# Altium schematic sheet 04 MCU_AB.SchDoc
size 513 x 386 mm
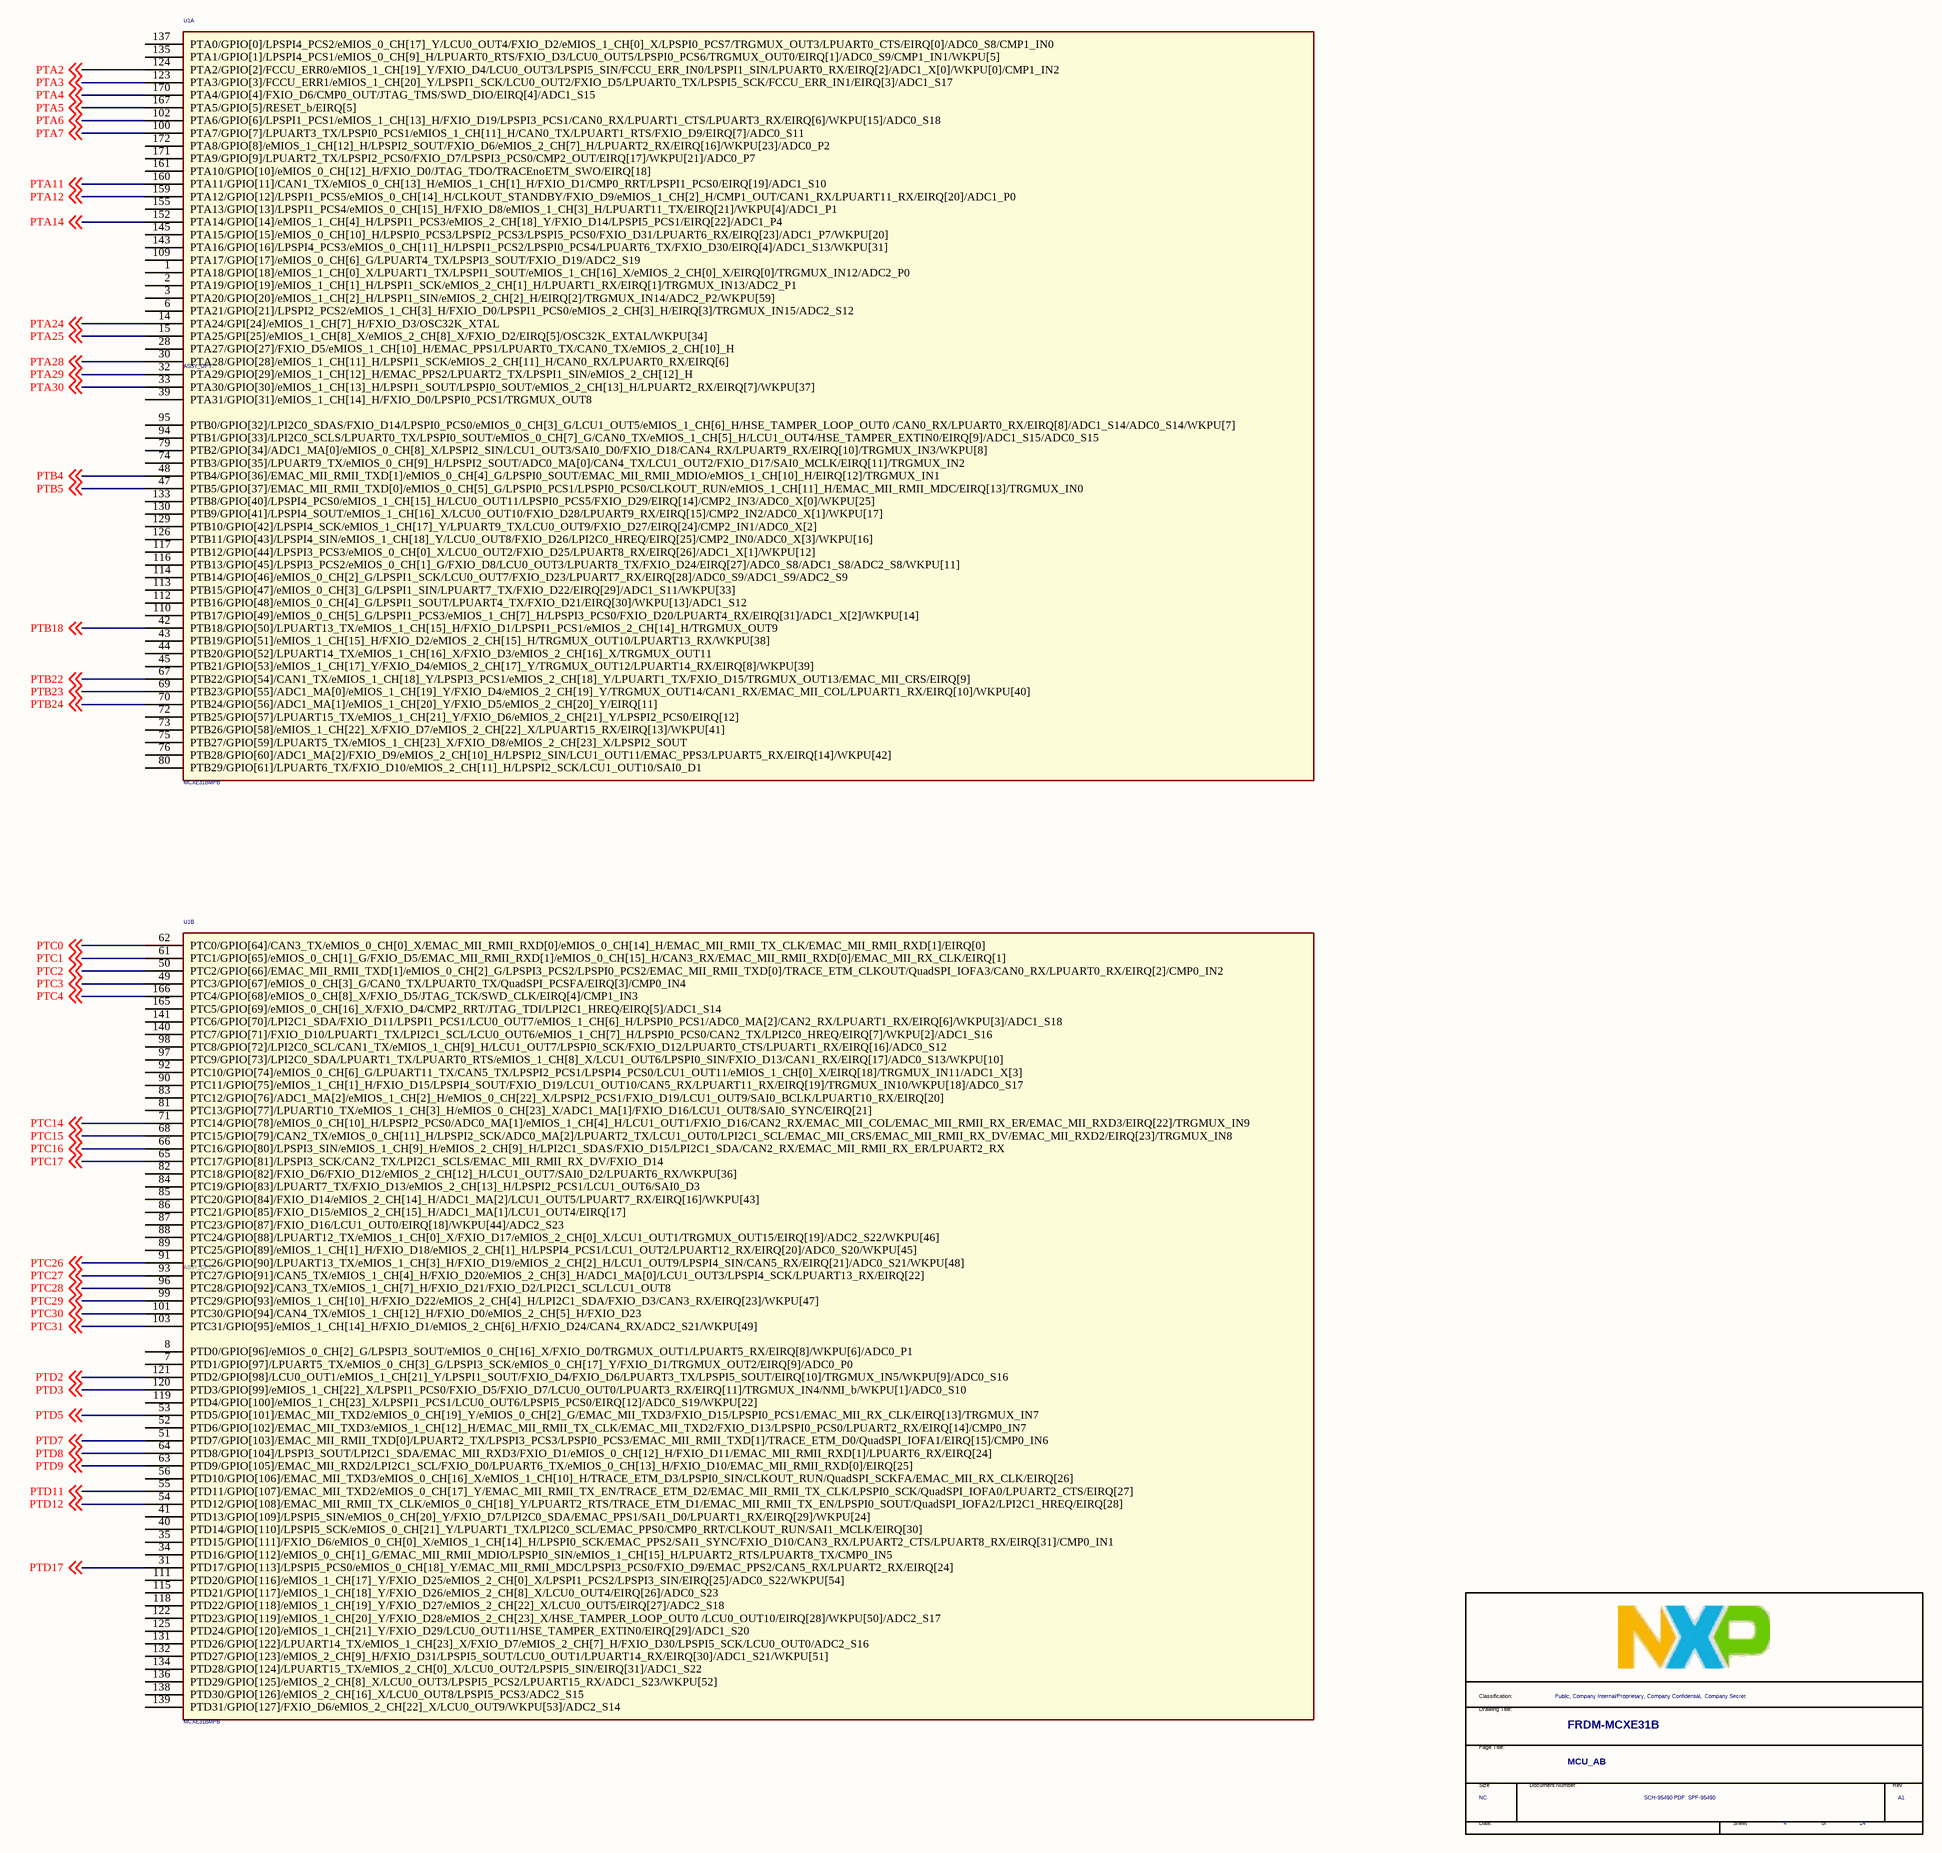
[diagram p0: 04 MCU_AB.SchDoc]

## Parts
*  Title: FRDM-MCXE31B  RevCode: A1  PageTitle: MCU_AB  Page Size: NC  Page Number: 4  Page Count: 14  Doc: SCH-95490 PDF: SPF-95490  Classification: Public, Company Internal/Proprietary, Company Confidential,  Company Secret  (hidden comment: TitleBlock_FS)  (graphical)
U1  MCXE31BMPB  [QFP-172_L16.0-W16.0-P0.65-LS19.0-TL]  (parts A,B of 4)

## Nets
PTA2: U1.124(PTA2/GPIO[2]/FCCU_ERR0/eMIOS_1_CH[19]_Y/FXIO_D4/LCU0_OUT3/LPSPI5_SIN/FCCU_ERR_IN0/LPSPI1_SIN/LPUART0_RX/EIRQ[2]/ADC1_X[0]/WKPU[0]/CMP1_IN2) ; off-sheet PTA2
PTA3: U1.123(PTA3/GPIO[3]/FCCU_ERR1/eMIOS_1_CH[20]_Y/LPSPI1_SCK/LCU0_OUT2/FXIO_D5/LPUART0_TX/LPSPI5_SCK/FCCU_ERR_IN1/EIRQ[3]/ADC1_S17) ; off-sheet PTA3
PTA4: U1.170(PTA4/GPIO[4]/FXIO_D6/CMP0_OUT/JTAG_TMS/SWD_DIO/EIRQ[4]/ADC1_S15) ; off-sheet PTA4
PTA5: U1.167(PTA5/GPIO[5]/RESET_b/EIRQ[5]) ; off-sheet PTA5
PTA6: U1.102(PTA6/GPIO[6]/LPSPI1_PCS1/eMIOS_1_CH[13]_H/FXIO_D19/LPSPI3_PCS1/CAN0_RX/LPUART1_CTS/LPUART3_RX/EIRQ[6]/WKPU[15]/ADC0_S18) ; off-sheet PTA6
PTA7: U1.100(PTA7/GPIO[7]/LPUART3_TX/LPSPI0_PCS1/eMIOS_1_CH[11]_H/CAN0_TX/LPUART1_RTS/FXIO_D9/EIRQ[7]/ADC0_S11) ; off-sheet PTA7
PTA11: U1.160(PTA11/GPIO[11]/CAN1_TX/eMIOS_0_CH[13]_H/eMIOS_1_CH[1]_H/FXIO_D1/CMP0_RRT/LPSPI1_PCS0/EIRQ[19]/ADC1_S10) ; off-sheet PTA11
PTA12: U1.159(PTA12/GPIO[12]/LPSPI1_PCS5/eMIOS_0_CH[14]_H/CLKOUT_STANDBY/FXIO_D9/eMIOS_1_CH[2]_H/CMP1_OUT/CAN1_RX/LPUART11_RX/EIRQ[20]/ADC1_P0) ; off-sheet PTA12
PTA14: U1.152(PTA14/GPIO[14]/eMIOS_1_CH[4]_H/LPSPI1_PCS3/eMIOS_2_CH[18]_Y/FXIO_D14/LPSPI5_PCS1/EIRQ[22]/ADC1_P4) ; off-sheet PTA14
PTA24: U1.14(PTA24/GPI[24]/eMIOS_1_CH[7]_H/FXIO_D3/OSC32K_XTAL) ; off-sheet PTA24
PTA25: U1.15(PTA25/GPI[25]/eMIOS_1_CH[8]_X/eMIOS_2_CH[8]_X/FXIO_D2/EIRQ[5]/OSC32K_EXTAL/WKPU[34]) ; off-sheet PTA25
PTA28: U1.30(PTA28/GPIO[28]/eMIOS_1_CH[11]_H/LPSPI1_SCK/eMIOS_2_CH[11]_H/CAN0_RX/LPUART0_RX/EIRQ[6]) ; off-sheet PTA28
PTA29: U1.32(PTA29/GPIO[29]/eMIOS_1_CH[12]_H/EMAC_PPS2/LPUART2_TX/LPSPI1_SIN/eMIOS_2_CH[12]_H) ; off-sheet PTA29
PTA30: U1.33(PTA30/GPIO[30]/eMIOS_1_CH[13]_H/LPSPI1_SOUT/LPSPI0_SOUT/eMIOS_2_CH[13]_H/LPUART2_RX/EIRQ[7]/WKPU[37]) ; off-sheet PTA30
PTB4: U1.48(PTB4/GPIO[36]/EMAC_MII_RMII_TXD[1]/eMIOS_0_CH[4]_G/LPSPI0_SOUT/EMAC_MII_RMII_MDIO/eMIOS_1_CH[10]_H/EIRQ[12]/TRGMUX_IN1) ; off-sheet PTB4
PTB5: U1.47(PTB5/GPIO[37]/EMAC_MII_RMII_TXD[0]/eMIOS_0_CH[5]_G/LPSPI0_PCS1/LPSPI0_PCS0/CLKOUT_RUN/eMIOS_1_CH[11]_H/EMAC_MII_RMII_MDC/EIRQ[13]/TRGMUX_IN0) ; off-sheet PTB5
PTB18: U1.42(PTB18/GPIO[50]/LPUART13_TX/eMIOS_1_CH[15]_H/FXIO_D1/LPSPI1_PCS1/eMIOS_2_CH[14]_H/TRGMUX_OUT9) ; off-sheet PTB18
PTB22: U1.67(PTB22/GPIO[54]/CAN1_TX/eMIOS_1_CH[18]_Y/LPSPI3_PCS1/eMIOS_2_CH[18]_Y/LPUART1_TX/FXIO_D15/TRGMUX_OUT13/EMAC_MII_CRS/EIRQ[9]) ; off-sheet PTB22
PTB23: U1.69(PTB23/GPIO[55]/ADC1_MA[0]/eMIOS_1_CH[19]_Y/FXIO_D4/eMIOS_2_CH[19]_Y/TRGMUX_OUT14/CAN1_RX/EMAC_MII_COL/LPUART1_RX/EIRQ[10]/WKPU[40]) ; off-sheet PTB23
PTB24: U1.70(PTB24/GPIO[56]/ADC1_MA[1]/eMIOS_1_CH[20]_Y/FXIO_D5/eMIOS_2_CH[20]_Y/EIRQ[11]) ; off-sheet PTB24
PTC0: U1.62(PTC0/GPIO[64]/CAN3_TX/eMIOS_0_CH[0]_X/EMAC_MII_RMII_RXD[0]/eMIOS_0_CH[14]_H/EMAC_MII_RMII_TX_CLK/EMAC_MII_RMII_RXD[1]/EIRQ[0]) ; off-sheet PTC0
PTC1: U1.61(PTC1/GPIO[65]/eMIOS_0_CH[1]_G/FXIO_D5/EMAC_MII_RMII_RXD[1]/eMIOS_0_CH[15]_H/CAN3_RX/EMAC_MII_RMII_RXD[0]/EMAC_MII_RX_CLK/EIRQ[1]) ; off-sheet PTC1
PTC2: U1.50(PTC2/GPIO[66]/EMAC_MII_RMII_TXD[1]/eMIOS_0_CH[2]_G/LPSPI3_PCS2/LPSPI0_PCS2/EMAC_MII_RMII_TXD[0]/TRACE_ETM_CLKOUT/QuadSPI_IOFA3/CAN0_RX/LPUART0_RX/EIRQ[2]/CMP0_IN2) ; off-sheet PTC2
PTC3: U1.49(PTC3/GPIO[67]/eMIOS_0_CH[3]_G/CAN0_TX/LPUART0_TX/QuadSPI_PCSFA/EIRQ[3]/CMP0_IN4) ; off-sheet PTC3
PTC4: U1.166(PTC4/GPIO[68]/eMIOS_0_CH[8]_X/FXIO_D5/JTAG_TCK/SWD_CLK/EIRQ[4]/CMP1_IN3) ; off-sheet PTC4
PTC14: U1.71(PTC14/GPIO[78]/eMIOS_0_CH[10]_H/LPSPI2_PCS0/ADC0_MA[1]/eMIOS_1_CH[4]_H/LCU1_OUT1/FXIO_D16/CAN2_RX/EMAC_MII_COL/EMAC_MII_RMII_RX_ER/EMAC_MII_RXD3/EIRQ[22]/TRGMUX_IN9) ; off-sheet PTC14
PTC15: U1.68(PTC15/GPIO[79]/CAN2_TX/eMIOS_0_CH[11]_H/LPSPI2_SCK/ADC0_MA[2]/LPUART2_TX/LCU1_OUT0/LPI2C1_SCL/EMAC_MII_CRS/EMAC_MII_RMII_RX_DV/EMAC_MII_RXD2/EIRQ[23]/TRGMUX_IN8) ; off-sheet PTC15
PTC16: U1.66(PTC16/GPIO[80]/LPSPI3_SIN/eMIOS_1_CH[9]_H/eMIOS_2_CH[9]_H/LPI2C1_SDAS/FXIO_D15/LPI2C1_SDA/CAN2_RX/EMAC_MII_RMII_RX_ER/LPUART2_RX) ; off-sheet PTC16
PTC17: U1.65(PTC17/GPIO[81]/LPSPI3_SCK/CAN2_TX/LPI2C1_SCLS/EMAC_MII_RMII_RX_DV/FXIO_D14) ; off-sheet PTC17
PTC26: U1.91(PTC26/GPIO[90]/LPUART13_TX/eMIOS_1_CH[3]_H/FXIO_D19/eMIOS_2_CH[2]_H/LCU1_OUT9/LPSPI4_SIN/CAN5_RX/EIRQ[21]/ADC0_S21/WKPU[48]) ; off-sheet PTC26
PTC27: U1.93(PTC27/GPIO[91]/CAN5_TX/eMIOS_1_CH[4]_H/FXIO_D20/eMIOS_2_CH[3]_H/ADC1_MA[0]/LCU1_OUT3/LPSPI4_SCK/LPUART13_RX/EIRQ[22]) ; off-sheet PTC27
PTC28: U1.96(PTC28/GPIO[92]/CAN3_TX/eMIOS_1_CH[7]_H/FXIO_D21/FXIO_D2/LPI2C1_SCL/LCU1_OUT8) ; off-sheet PTC28
PTC29: U1.99(PTC29/GPIO[93]/eMIOS_1_CH[10]_H/FXIO_D22/eMIOS_2_CH[4]_H/LPI2C1_SDA/FXIO_D3/CAN3_RX/EIRQ[23]/WKPU[47]) ; off-sheet PTC29
PTC30: U1.101(PTC30/GPIO[94]/CAN4_TX/eMIOS_1_CH[12]_H/FXIO_D0/eMIOS_2_CH[5]_H/FXIO_D23) ; off-sheet PTC30
PTC31: U1.103(PTC31/GPIO[95]/eMIOS_1_CH[14]_H/FXIO_D1/eMIOS_2_CH[6]_H/FXIO_D24/CAN4_RX/ADC2_S21/WKPU[49]) ; off-sheet PTC31
PTD2: U1.121(PTD2/GPIO[98]/LCU0_OUT1/eMIOS_1_CH[21]_Y/LPSPI1_SOUT/FXIO_D4/FXIO_D6/LPUART3_TX/LPSPI5_SOUT/EIRQ[10]/TRGMUX_IN5/WKPU[9]/ADC0_S16) ; off-sheet PTD2
PTD3: U1.120(PTD3/GPIO[99]/eMIOS_1_CH[22]_X/LPSPI1_PCS0/FXIO_D5/FXIO_D7/LCU0_OUT0/LPUART3_RX/EIRQ[11]/TRGMUX_IN4/NMI_b/WKPU[1]/ADC0_S10) ; off-sheet PTD3
PTD5: U1.53(PTD5/GPIO[101]/EMAC_MII_TXD2/eMIOS_0_CH[19]_Y/eMIOS_0_CH[2]_G/EMAC_MII_TXD3/FXIO_D15/LPSPI0_PCS1/EMAC_MII_RX_CLK/EIRQ[13]/TRGMUX_IN7) ; off-sheet PTD5
PTD7: U1.51(PTD7/GPIO[103]/EMAC_MII_RMII_TXD[0]/LPUART2_TX/LPSPI3_PCS3/LPSPI0_PCS3/EMAC_MII_RMII_TXD[1]/TRACE_ETM_D0/QuadSPI_IOFA1/EIRQ[15]/CMP0_IN6) ; off-sheet PTD7
PTD8: U1.64(PTD8/GPIO[104]/LPSPI3_SOUT/LPI2C1_SDA/EMAC_MII_RXD3/FXIO_D1/eMIOS_0_CH[12]_H/FXIO_D11/EMAC_MII_RMII_RXD[1]/LPUART6_RX/EIRQ[24]) ; off-sheet PTD8
PTD9: U1.63(PTD9/GPIO[105]/EMAC_MII_RXD2/LPI2C1_SCL/FXIO_D0/LPUART6_TX/eMIOS_0_CH[13]_H/FXIO_D10/EMAC_MII_RMII_RXD[0]/EIRQ[25]) ; off-sheet PTD9
PTD11: U1.55(PTD11/GPIO[107]/EMAC_MII_TXD2/eMIOS_0_CH[17]_Y/EMAC_MII_RMII_TX_EN/TRACE_ETM_D2/EMAC_MII_RMII_TX_CLK/LPSPI0_SCK/QuadSPI_IOFA0/LPUART2_CTS/EIRQ[27]) ; off-sheet PTD11
PTD12: U1.54(PTD12/GPIO[108]/EMAC_MII_RMII_TX_CLK/eMIOS_0_CH[18]_Y/LPUART2_RTS/TRACE_ETM_D1/EMAC_MII_RMII_TX_EN/LPSPI0_SOUT/QuadSPI_IOFA2/LPI2C1_HREQ/EIRQ[28]) ; off-sheet PTD12
PTD17: U1.31(PTD17/GPIO[113]/LPSPI5_PCS0/eMIOS_0_CH[18]_Y/EMAC_MII_RMII_MDC/LPSPI3_PCS0/FXIO_D9/EMAC_PPS2/CAN5_RX/LPUART2_RX/EIRQ[24]) ; off-sheet PTD17

Not connected (* = marked no-connect by the designer): U1 1(PTA18/GPIO[18]/eMIOS_1_CH[0]_X/LPUART1_TX/LPSPI1_SOUT/eMIOS_1_CH[16]_X/eMIOS_2_CH[0]_X/EIRQ[0]/TRGMUX_IN12/ADC2_P0) 2(PTA19/GPIO[19]/eMIOS_1_CH[1]_H/LPSPI1_SCK/eMIOS_2_CH[1]_H/LPUART1_RX/EIRQ[1]/TRGMUX_IN13/ADC2_P1) 3(PTA20/GPIO[20]/eMIOS_1_CH[2]_H/LPSPI1_SIN/eMIOS_2_CH[2]_H/EIRQ[2]/TRGMUX_IN14/ADC2_P2/WKPU[59]) 6(PTA21/GPIO[21]/LPSPI2_PCS2/eMIOS_1_CH[3]_H/FXIO_D0/LPSPI1_PCS0/eMIOS_2_CH[3]_H/EIRQ[3]/TRGMUX_IN15/ADC2_S12) 7(PTD1/GPIO[97]/LPUART5_TX/eMIOS_0_CH[3]_G/LPSPI3_SCK/eMIOS_0_CH[17]_Y/FXIO_D1/TRGMUX_OUT2/EIRQ[9]/ADC0_P0) 8(PTD0/GPIO[96]/eMIOS_0_CH[2]_G/LPSPI3_SOUT/eMIOS_0_CH[16]_X/FXIO_D0/TRGMUX_OUT1/LPUART5_RX/EIRQ[8]/WKPU[6]/ADC0_P1) 28(PTA27/GPIO[27]/FXIO_D5/eMIOS_1_CH[10]_H/EMAC_PPS1/LPUART0_TX/CAN0_TX/eMIOS_2_CH[10]_H) 34(PTD16/GPIO[112]/eMIOS_0_CH[1]_G/EMAC_MII_RMII_MDIO/LPSPI0_SIN/eMIOS_1_CH[15]_H/LPUART2_RTS/LPUART8_TX/CMP0_IN5) 35(PTD15/GPIO[111]/FXIO_D6/eMIOS_0_CH[0]_X/eMIOS_1_CH[14]_H/LPSPI0_SCK/EMAC_PPS2/SAI1_SYNC/FXIO_D10/CAN3_RX/LPUART2_CTS/LPUART8_RX/EIRQ[31]/CMP0_IN1) 39(PTA31/GPIO[31]/eMIOS_1_CH[14]_H/FXIO_D0/LPSPI0_PCS1/TRGMUX_OUT8) 40(PTD14/GPIO[110]/LPSPI5_SCK/eMIOS_0_CH[21]_Y/LPUART1_TX/LPI2C0_SCL/EMAC_PPS0/CMP0_RRT/CLKOUT_RUN/SAI1_MCLK/EIRQ[30]) 41(PTD13/GPIO[109]/LPSPI5_SIN/eMIOS_0_CH[20]_Y/FXIO_D7/LPI2C0_SDA/EMAC_PPS1/SAI1_D0/LPUART1_RX/EIRQ[29]/WKPU[24]) 43(PTB19/GPIO[51]/eMIOS_1_CH[15]_H/FXIO_D2/eMIOS_2_CH[15]_H/TRGMUX_OUT10/LPUART13_RX/WKPU[38]) 44(PTB20/GPIO[52]/LPUART14_TX/eMIOS_1_CH[16]_X/FXIO_D3/eMIOS_2_CH[16]_X/TRGMUX_OUT11) 45(PTB21/GPIO[53]/eMIOS_1_CH[17]_Y/FXIO_D4/eMIOS_2_CH[17]_Y/TRGMUX_OUT12/LPUART14_RX/EIRQ[8]/WKPU[39]) 52(PTD6/GPIO[102]/EMAC_MII_TXD3/eMIOS_1_CH[12]_H/EMAC_MII_RMII_TX_CLK/EMAC_MII_TXD2/FXIO_D13/LPSPI0_PCS0/LPUART2_RX/EIRQ[14]/CMP0_IN7) 56(PTD10/GPIO[106]/EMAC_MII_TXD3/eMIOS_0_CH[16]_X/eMIOS_1_CH[10]_H/TRACE_ETM_D3/LPSPI0_SIN/CLKOUT_RUN/QuadSPI_SCKFA/EMAC_MII_RX_CLK/EIRQ[26]) 72(PTB25/GPIO[57]/LPUART15_TX/eMIOS_1_CH[21]_Y/FXIO_D6/eMIOS_2_CH[21]_Y/LPSPI2_PCS0/EIRQ[12]) 73(PTB26/GPIO[58]/eMIOS_1_CH[22]_X/FXIO_D7/eMIOS_2_CH[22]_X/LPUART15_RX/EIRQ[13]/WKPU[41]) 74(PTB3/GPIO[35]/LPUART9_TX/eMIOS_0_CH[9]_H/LPSPI2_SOUT/ADC0_MA[0]/CAN4_TX/LCU1_OUT2/FXIO_D17/SAI0_MCLK/EIRQ[11]/TRGMUX_IN2) 75(PTB27/GPIO[59]/LPUART5_TX/eMIOS_1_CH[23]_X/FXIO_D8/eMIOS_2_CH[23]_X/LPSPI2_SOUT) 76(PTB28/GPIO[60]/ADC1_MA[2]/FXIO_D9/eMIOS_2_CH[10]_H/LPSPI2_SIN/LCU1_OUT11/EMAC_PPS3/LPUART5_RX/EIRQ[14]/WKPU[42]) 79(PTB2/GPIO[34]/ADC1_MA[0]/eMIOS_0_CH[8]_X/LPSPI2_SIN/LCU1_OUT3/SAI0_D0/FXIO_D18/CAN4_RX/LPUART9_RX/EIRQ[10]/TRGMUX_IN3/WKPU[8]) 80(PTB29/GPIO[61]/LPUART6_TX/FXIO_D10/eMIOS_2_CH[11]_H/LPSPI2_SCK/LCU1_OUT10/SAI0_D1) 81(PTC13/GPIO[77]/LPUART10_TX/eMIOS_1_CH[3]_H/eMIOS_0_CH[23]_X/ADC1_MA[1]/FXIO_D16/LCU1_OUT8/SAI0_SYNC/EIRQ[21]) 82(PTC18/GPIO[82]/FXIO_D6/FXIO_D12/eMIOS_2_CH[12]_H/LCU1_OUT7/SAI0_D2/LPUART6_RX/WKPU[36]) 83(PTC12/GPIO[76]/ADC1_MA[2]/eMIOS_1_CH[2]_H/eMIOS_0_CH[22]_X/LPSPI2_PCS1/FXIO_D19/LCU1_OUT9/SAI0_BCLK/LPUART10_RX/EIRQ[20]) 84(PTC19/GPIO[83]/LPUART7_TX/FXIO_D13/eMIOS_2_CH[13]_H/LPSPI2_PCS1/LCU1_OUT6/SAI0_D3) 85(PTC20/GPIO[84]/FXIO_D14/eMIOS_2_CH[14]_H/ADC1_MA[2]/LCU1_OUT5/LPUART7_RX/EIRQ[16]/WKPU[43]) 86(PTC21/GPIO[85]/FXIO_D15/eMIOS_2_CH[15]_H/ADC1_MA[1]/LCU1_OUT4/EIRQ[17]) 87(PTC23/GPIO[87]/FXIO_D16/LCU1_OUT0/EIRQ[18]/WKPU[44]/ADC2_S23) 88(PTC24/GPIO[88]/LPUART12_TX/eMIOS_1_CH[0]_X/FXIO_D17/eMIOS_2_CH[0]_X/LCU1_OUT1/TRGMUX_OUT15/EIRQ[19]/ADC2_S22/WKPU[46]) 89(PTC25/GPIO[89]/eMIOS_1_CH[1]_H/FXIO_D18/eMIOS_2_CH[1]_H/LPSPI4_PCS1/LCU1_OUT2/LPUART12_RX/EIRQ[20]/ADC0_S20/WKPU[45]) 90(PTC11/GPIO[75]/eMIOS_1_CH[1]_H/FXIO_D15/LPSPI4_SOUT/FXIO_D19/LCU1_OUT10/CAN5_RX/LPUART11_RX/EIRQ[19]/TRGMUX_IN10/WKPU[18]/ADC0_S17) 92(PTC10/GPIO[74]/eMIOS_0_CH[6]_G/LPUART11_TX/CAN5_TX/LPSPI2_PCS1/LPSPI4_PCS0/LCU1_OUT11/eMIOS_1_CH[0]_X/EIRQ[18]/TRGMUX_IN11/ADC1_X[3]) 94(PTB1/GPIO[33]/LPI2C0_SCLS/LPUART0_TX/LPSPI0_SOUT/eMIOS_0_CH[7]_G/CAN0_TX/eMIOS_1_CH[5]_H/LCU1_OUT4/HSE_TAMPER_EXTIN0/EIRQ[9]/ADC1_S15/ADC0_S15) 95(PTB0/GPIO[32]/LPI2C0_SDAS/FXIO_D14/LPSPI0_PCS0/eMIOS_0_CH[3]_G/LCU1_OUT5/eMIOS_1_CH[6]_H/HSE_TAMPER_LOOP_OUT0_/CAN0_RX/LPUART0_RX/EIRQ[8]/ADC1_S14/ADC0_S14/WKPU[7]) 97(PTC9/GPIO[73]/LPI2C0_SDA/LPUART1_TX/LPUART0_RTS/eMIOS_1_CH[8]_X/LCU1_OUT6/LPSPI0_SIN/FXIO_D13/CAN1_RX/EIRQ[17]/ADC0_S13/WKPU[10]) 98(PTC8/GPIO[72]/LPI2C0_SCL/CAN1_TX/eMIOS_1_CH[9]_H/LCU1_OUT7/LPSPI0_SCK/FXIO_D12/LPUART0_CTS/LPUART1_RX/EIRQ[16]/ADC0_S12) 109(PTA17/GPIO[17]/eMIOS_0_CH[6]_G/LPUART4_TX/LPSPI3_SOUT/FXIO_D19/ADC2_S19) 110(PTB17/GPIO[49]/eMIOS_0_CH[5]_G/LPSPI1_PCS3/eMIOS_1_CH[7]_H/LPSPI3_PCS0/FXIO_D20/LPUART4_RX/EIRQ[31]/ADC1_X[2]/WKPU[14]) 111(PTD20/GPIO[116]/eMIOS_1_CH[17]_Y/FXIO_D25/eMIOS_2_CH[0]_X/LPSPI1_PCS2/LPSPI3_SIN/EIRQ[25]/ADC0_S22/WKPU[54]) 112(PTB16/GPIO[48]/eMIOS_0_CH[4]_G/LPSPI1_SOUT/LPUART4_TX/FXIO_D21/EIRQ[30]/WKPU[13]/ADC1_S12) 113(PTB15/GPIO[47]/eMIOS_0_CH[3]_G/LPSPI1_SIN/LPUART7_TX/FXIO_D22/EIRQ[29]/ADC1_S11/WKPU[33]) 114(PTB14/GPIO[46]/eMIOS_0_CH[2]_G/LPSPI1_SCK/LCU0_OUT7/FXIO_D23/LPUART7_RX/EIRQ[28]/ADC0_S9/ADC1_S9/ADC2_S9) 115(PTD21/GPIO[117]/eMIOS_1_CH[18]_Y/FXIO_D26/eMIOS_2_CH[8]_X/LCU0_OUT4/EIRQ[26]/ADC0_S23) 116(PTB13/GPIO[45]/LPSPI3_PCS2/eMIOS_0_CH[1]_G/FXIO_D8/LCU0_OUT3/LPUART8_TX/FXIO_D24/EIRQ[27]/ADC0_S8/ADC1_S8/ADC2_S8/WKPU[11]) 117(PTB12/GPIO[44]/LPSPI3_PCS3/eMIOS_0_CH[0]_X/LCU0_OUT2/FXIO_D25/LPUART8_RX/EIRQ[26]/ADC1_X[1]/WKPU[12]) 118(PTD22/GPIO[118]/eMIOS_1_CH[19]_Y/FXIO_D27/eMIOS_2_CH[22]_X/LCU0_OUT5/EIRQ[27]/ADC2_S18) 119(PTD4/GPIO[100]/eMIOS_1_CH[23]_X/LPSPI1_PCS1/LCU0_OUT6/LPSPI5_PCS0/EIRQ[12]/ADC0_S19/WKPU[22]) 122(PTD23/GPIO[119]/eMIOS_1_CH[20]_Y/FXIO_D28/eMIOS_2_CH[23]_X/HSE_TAMPER_LOOP_OUT0_/LCU0_OUT10/EIRQ[28]/WKPU[50]/ADC2_S17) 125(PTD24/GPIO[120]/eMIOS_1_CH[21]_Y/FXIO_D29/LCU0_OUT11/HSE_TAMPER_EXTIN0/EIRQ[29]/ADC1_S20) 126(PTB11/GPIO[43]/LPSPI4_SIN/eMIOS_1_CH[18]_Y/LCU0_OUT8/FXIO_D26/LPI2C0_HREQ/EIRQ[25]/CMP2_IN0/ADC0_X[3]/WKPU[16]) 129(PTB10/GPIO[42]/LPSPI4_SCK/eMIOS_1_CH[17]_Y/LPUART9_TX/LCU0_OUT9/FXIO_D27/EIRQ[24]/CMP2_IN1/ADC0_X[2]) 130(PTB9/GPIO[41]/LPSPI4_SOUT/eMIOS_1_CH[16]_X/LCU0_OUT10/FXIO_D28/LPUART9_RX/EIRQ[15]/CMP2_IN2/ADC0_X[1]/WKPU[17]) 131(PTD26/GPIO[122]/LPUART14_TX/eMIOS_1_CH[23]_X/FXIO_D7/eMIOS_2_CH[7]_H/FXIO_D30/LPSPI5_SCK/LCU0_OUT0/ADC2_S16) 132(PTD27/GPIO[123]/eMIOS_2_CH[9]_H/FXIO_D31/LPSPI5_SOUT/LCU0_OUT1/LPUART14_RX/EIRQ[30]/ADC1_S21/WKPU[51]) 133(PTB8/GPIO[40]/LPSPI4_PCS0/eMIOS_1_CH[15]_H/LCU0_OUT11/LPSPI0_PCS5/FXIO_D29/EIRQ[14]/CMP2_IN3/ADC0_X[0]/WKPU[25]) 134(PTD28/GPIO[124]/LPUART15_TX/eMIOS_2_CH[0]_X/LCU0_OUT2/LPSPI5_SIN/EIRQ[31]/ADC1_S22) 135(PTA1/GPIO[1]/LPSPI4_PCS1/eMIOS_0_CH[9]_H/LPUART0_RTS/FXIO_D3/LCU0_OUT5/LPSPI0_PCS6/TRGMUX_OUT0/EIRQ[1]/ADC0_S9/CMP1_IN1/WKPU[5]) 136(PTD29/GPIO[125]/eMIOS_2_CH[8]_X/LCU0_OUT3/LPSPI5_PCS2/LPUART15_RX/ADC1_S23/WKPU[52]) 137(PTA0/GPIO[0]/LPSPI4_PCS2/eMIOS_0_CH[17]_Y/LCU0_OUT4/FXIO_D2/eMIOS_1_CH[0]_X/LPSPI0_PCS7/TRGMUX_OUT3/LPUART0_CTS/EIRQ[0]/ADC0_S8/CMP1_IN0) 138(PTD30/GPIO[126]/eMIOS_2_CH[16]_X/LCU0_OUT8/LPSPI5_PCS3/ADC2_S15) 139(PTD31/GPIO[127]/FXIO_D6/eMIOS_2_CH[22]_X/LCU0_OUT9/WKPU[53]/ADC2_S14) 140(PTC7/GPIO[71]/FXIO_D10/LPUART1_TX/LPI2C1_SCL/LCU0_OUT6/eMIOS_1_CH[7]_H/LPSPI0_PCS0/CAN2_TX/LPI2C0_HREQ/EIRQ[7]/WKPU[2]/ADC1_S16) 141(PTC6/GPIO[70]/LPI2C1_SDA/FXIO_D11/LPSPI1_PCS1/LCU0_OUT7/eMIOS_1_CH[6]_H/LPSPI0_PCS1/ADC0_MA[2]/CAN2_RX/LPUART1_RX/EIRQ[6]/WKPU[3]/ADC1_S18) 143(PTA16/GPIO[16]/LPSPI4_PCS3/eMIOS_0_CH[11]_H/LPSPI1_PCS2/LPSPI0_PCS4/LPUART6_TX/FXIO_D30/EIRQ[4]/ADC1_S13/WKPU[31]) 145(PTA15/GPIO[15]/eMIOS_0_CH[10]_H/LPSPI0_PCS3/LPSPI2_PCS3/LPSPI5_PCS0/FXIO_D31/LPUART6_RX/EIRQ[23]/ADC1_P7/WKPU[20]) 155(PTA13/GPIO[13]/LPSPI1_PCS4/eMIOS_0_CH[15]_H/FXIO_D8/eMIOS_1_CH[3]_H/LPUART11_TX/EIRQ[21]/WKPU[4]/ADC1_P1) 161(PTA10/GPIO[10]/eMIOS_0_CH[12]_H/FXIO_D0/JTAG_TDO/TRACEnoETM_SWO/EIRQ[18]) 165(PTC5/GPIO[69]/eMIOS_0_CH[16]_X/FXIO_D4/CMP2_RRT/JTAG_TDI/LPI2C1_HREQ/EIRQ[5]/ADC1_S14) 171(PTA9/GPIO[9]/LPUART2_TX/LPSPI2_PCS0/FXIO_D7/LPSPI3_PCS0/CMP2_OUT/EIRQ[17]/WKPU[21]/ADC0_P7) 172(PTA8/GPIO[8]/eMIOS_1_CH[12]_H/LPSPI2_SOUT/FXIO_D6/eMIOS_2_CH[7]_H/LPUART2_RX/EIRQ[16]/WKPU[23]/ADC0_P2)

## Notes on the sheet
- (in symbol TitleBlock_FS) Classification:; Drawing Title:; Page Title:; Size; Document Number; Rev; Date:; Sheet; of

## Library data of the parts
* = TitleBlock_FS: OrgName: NXP Semiconductors; OrgAddr1: 6501 William Cannon Drive West; OrgAddr2: Austin, TX 78735-8598; Page Create Date: March  8, 1995
U1 = MCXE318MPB_172P: IC MCU 4M FLASH 2.97-5.5V 160MHZ HDQFP172; AGILE_PN: TMP-CIP-19819; CAD_APPROVED: Yes; PRE_APN: 344-10070; Temp Range: -40°C to +125°C; MFG_NAME01: NXP SEMICONDUCTOR; CLASS: IC; HEIGHT: 1.75mm; ROHS: NULL; MFG_PN01: MCXE31BMPB; 3D_Mechanical_Footprint_File: http://fcl.am.freescale.net/ALLEGRO/step/hdqfp172_0P65_16X16_sm.STEP